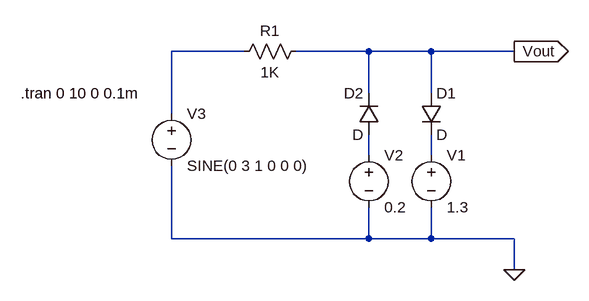
[diagram p0: schematic two_end_clipper.asc]
two_end_clipper.asc, the LTspice schematic file:
Version 4
SHEET 1 880 680
WIRE 0 112 -112 112
WIRE 192 112 80 112
WIRE 288 112 192 112
WIRE 416 112 288 112
WIRE 192 176 192 112
WIRE 288 176 288 112
WIRE -112 208 -112 112
WIRE 192 272 192 240
WIRE 288 272 288 240
WIRE -112 400 -112 288
WIRE 192 400 192 352
WIRE 192 400 -112 400
WIRE 288 400 288 352
WIRE 288 400 192 400
WIRE 416 400 288 400
WIRE 416 448 416 400
FLAG 416 448 0
FLAG 416 112 Vout
IOPIN 416 112 Out
SYMBOL res 96 96 R90
WINDOW 0 0 56 VBottom 2
WINDOW 3 32 56 VTop 2
SYMATTR InstName R1
SYMATTR Value 1K
SYMBOL diode 272 176 R0
SYMATTR InstName D1
SYMBOL diode 208 240 R180
WINDOW 0 24 64 Left 2
WINDOW 3 24 0 Left 2
SYMATTR InstName D2
SYMBOL voltage 288 256 R0
WINDOW 123 0 0 Left 0
WINDOW 39 0 0 Left 0
SYMATTR InstName V1
SYMATTR Value 1.3
SYMBOL voltage 192 256 R0
WINDOW 123 0 0 Left 0
WINDOW 39 0 0 Left 0
SYMATTR InstName V2
SYMATTR Value 0.2
SYMBOL voltage -112 192 R0
WINDOW 123 0 0 Left 0
WINDOW 39 0 0 Left 0
SYMATTR InstName V3
SYMATTR Value SINE(0 3 1 0 0 0)
TEXT -344 176 Left 2 !.tran 0 10 0 0.1m

The netlist it stands for:
* two_end_clipper.asc
R1 Vout N001 1K
D1 Vout N003 D
D2 N002 Vout D
V1 N003 0 1.3
V2 N002 0 0.2
V3 N001 0 SINE(0 3 1 0 0 0)
.model D D
.lib standard.dio
.tran 0 10 0 0.1m
.backanno
.end